# Altium project AWSAM5_CS704.PrjPcb
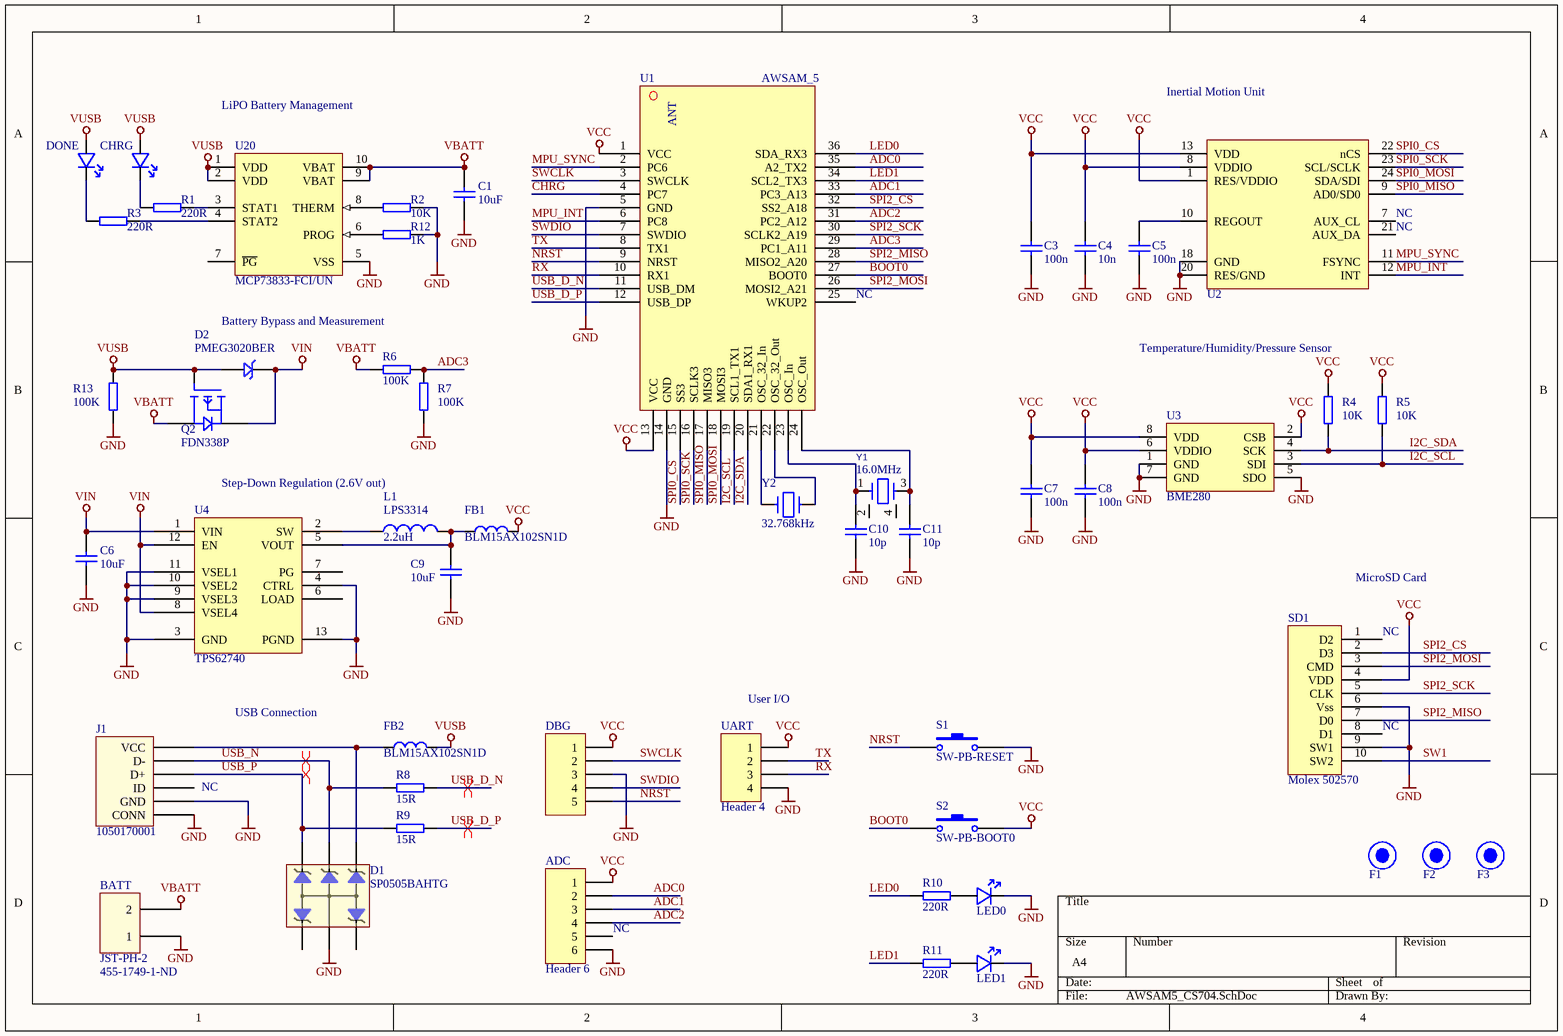
[diagram p0: AWSAM5_CS704.SchDoc]
1 sheet, 51 parts. Net scope: global (net labels, ports and power ports of the same name join across sheets).
Board files: AWSAM5_CS704.PcbDoc, AWSAM5_CS704_PANEL.PcbDoc

## Sheet AWSAM5_CS704.SchDoc
size A4; PageSetup: Record=PageOptions|CenterHorizontal=True|CenterVertical=True|PrintScale=1.00|XCorrection=1.00|YCorrection=1.00|PrintKind=0|BorderSize=5000000|LeftOffset=0|BottomOffset=0|Orientation=2|PaperLength=1000|PaperWidth=1000|Scale=100|PaperSource=7|PrintQuality=-4|MediaType=1|DitherType=10|PaperKind=A4|PrintScaleMode=1

### Parts
ADC  Header 6  [HDR1X6]
BATT  JST-PH-2  Supplier Part Number 1: 455-1749-1-ND  [JST-PH-2POS]
C1  value 10uF  [CAP0603]  (hidden comment: CAP)
C3  value 100n  [CAP0402]  (hidden comment: CAP)
C4  value 10n  [CAP0402]  (hidden comment: CAP)
C5  value 100n  [CAP0402]  (hidden comment: CAP)
C6  value 10uF  [CAP0603]  (hidden comment: CAP)
C7  value 100n  [CAP0402]  (hidden comment: CAP)
C8  value 100n  [CAP0402]  (hidden comment: CAP)
C9  value 10uF  [CAP0603]  (hidden comment: CAP)
C10  value 10p  [CAP0402]  (hidden comment: CAP)
C11  value 10p  [CAP0402]  (hidden comment: CAP)
CHRG  LED  [LED0603P]  (value not drawn)
D1  SP0505BAHTG  [SOT26A-6L]
D2  Part Number: PMEG3020BER  [SODFL350X110-2N]  (hidden comment: DIODE-SCHOTTKY)
DBG  (no value)  [HDR1X5]
DONE  LED  [LED0603P]  (value not drawn)
F1  FIDUCIAL  [FIDUCIAL-1MM]  (value not drawn)
F2  FIDUCIAL  [FIDUCIAL-1MM]  (value not drawn)
F3  FIDUCIAL  [FIDUCIAL-1MM]  (value not drawn)
FB1  Part Number: BLM15AX102SN1D  [IND0402]  (hidden comment: IND)
FB2  Part Number: BLM15AX102SN1D  [IND0402]  (hidden comment: IND)
J1  1050170001  [1050170001]
L1  LPS3314  value 2.2uH  [CoilCraft- LPS3314]
LED0  LED  [LED0603P]  (value not drawn)
LED1  LED  [LED0603P]  (value not drawn)
Q2  Part Number: FDN338P  [SOT23-3]  (hidden comment: FET-PCH-DIODE)
R1  value 220R  [SMT0402]  (hidden comment: Resistor)
R2  value 10K  [SMT0402]  (hidden comment: RES)
R3  value 220R  [SMT0402]  (hidden comment: Resistor)
R4  value 10K  [SMT0402]  (hidden comment: RES)
R5  value 10K  [SMT0402]  (hidden comment: RES)
R6  value 100K  [SMT0402]  (hidden comment: RES)
R7  value 100K  [SMT0402]  (hidden comment: RES)
R8  15R  [SMT0402]
R9  value 15R  [SMT0402]  (hidden comment: Resistor)
R10  value 220R  [SMT0402]  (hidden comment: Resistor)
R11  value 220R  [SMT0402]  (hidden comment: Resistor)
R12  value 1K  [SMT0402]  (hidden comment: RES)
R13  value 100K  [RES0402]  (hidden comment: RES)
S1  SW-PB-RESET  [MC32882 Switch]
S2  SW-PB-BOOT0  [MC32882 Switch]
SD1  Molex 502570  [micro SD]
U1  AWSAM_5  [AWSAM_5]
U2  MPU-9250  [QFN40P300X300X105_HS-25L]  (value not drawn)
U3  BME280  [BME280]
U4  TPS62740  [TPS62740_12Pin]
U20  MCP73833-FCI/UN  [MSOP-UN10_N]
UART  Header 4  [HDR1X4]
Y1  value 16.0MHz  [AP7-00061]  (hidden comment: TSX-3225)
Y2  Frequency: 32.768kHz  [SMD Crystal 32kHz]  (hidden comment: CM315-32.768KEZF-UT)

### Nets
GND: ADC.6 BATT.1 C1.1 C3.1 C4.1 C5.1 C6.1 C7.1 C8.1 C9.1 C10.1 C11.1 D1.2 DBG.3 J1.0(CONN) J1.5(GND) LED0.2 LED1.2 R2.2 R7.1 R12.2 R13.1 S1.2 SD1.6(Vss) SD1.9(SW1) U1.5(GND) U1.14(GND) U2.18(GND) U2.20(RES/GND) U3.1(GND) U3.5(SDO) U3.7(GND) U4.3(GND) U4.4(CTRL) U4.9(VSEL3) U4.10(VSEL2) U4.11(VSEL1) U4.13(PGND) U20.5(VSS) UART.4
VBATT: BATT.2 C1.2 Q2.3 R6.2 U20.9(VBAT) U20.10(VBAT)
VCC: ADC.1 C3.2 C4.2 C7.2 C8.2 DBG.1 FB1.2 R4.2 R5.2 S2.2 SD1.4(VDD) U1.1(VCC) U1.13(VCC) U2.1(RES/VDDIO) U2.8(VDDIO) U2.13(VDD) U3.2(CSB) U3.6(VDDIO) U3.8(VDD) UART.1
VIN: C6.2 D2.1 Q2.2 U4.1(VIN) U4.8(VSEL4) U4.12(EN)
VUSB: CHRG.1 D2.2 DONE.1 FB2.2 Q2.1 R13.2 U20.1(VDD) U20.2(VDD)
ADC0: ADC.2 U1.35(A2_TX2)
ADC1: ADC.3 U1.33(PC3_A13)
ADC2: ADC.4 U1.31(PC2_A12)
ADC3: R6.1 R7.2 U1.29(PC1_A11)
BOOT0: S2.1 U1.27(BOOT0)
CHRG: U1.4(PC7)
I2C_SCL: R5.1 U1.19(SCL1_TX1) U3.3(SDI)
I2C_SDA: R4.1 U1.20(SDA1_RX1) U3.4(SCK)
LED0: R10.2 U1.36(SDA_RX3)
LED1: R11.2 U1.34(SCL2_TX3)
MPU_INT: U1.6(PC8) U2.12(INT)
MPU_SYNC: U1.2(PC6) U2.11(FSYNC)
NRST: DBG.5 S1.1 U1.9(NRST)
RX: U1.10(RX1) UART.3
SPI0_CS: U1.15(SS3) U2.22(nCS)
SPI0_MISO: U1.17(MISO3) U2.9(AD0/SD0)
SPI0_MOSI: U1.18(MOSI3) U2.24(SDA/SDI)
SPI0_SCK: U1.16(SCLK3) U2.23(SCL/SCLK)
SPI2_CS: SD1.2(D3) U1.32(SS2_A18)
SPI2_MISO: SD1.7(D0) U1.28(MISO2_A20)
SPI2_MOSI: SD1.3(CMD) U1.26(MOSI2_A21)
SPI2_SCK: SD1.5(CLK) U1.30(SCLK2_A19)
SW1: SD1.10(SW2)
SWCLK: DBG.2 U1.3(SWCLK)
SWDIO: DBG.4 U1.7(SWDIO)
TX: U1.8(TX1) UART.2
USB_D_N: R8.1 U1.11(USB_DM)
USB_D_P: R9.1 U1.12(USB_DP)
USB_N: D1.5 J1.2(D-) R8.2
USB_P: D1.6 J1.3(D+) R9.2
NetC5_2: C5.2 U2.10(REGOUT)
NetC9_2: C9.2 FB1.1 L1.2 U4.5(VOUT)
NetC10_2: C10.2 U1.23(OSC_In) Y1.1(IN)
NetC11_2: C11.2 U1.24(OSC_Out) Y1.3(OUT)
NetCHRG_2: CHRG.2 R1.2
NetD1_4: D1.4 FB2.1 J1.1(VCC)
NetDONE_2: DONE.2 R3.2
NetL1_1: L1.1 U4.2(SW)
NetLED0_1: LED0.1 R10.1
NetLED1_1: LED1.1 R11.1
NetR1_1: R1.1 U20.3(STAT1)
NetR2_1: R2.1 U20.8(THERM)
NetR3_1: R3.1 U20.4(STAT2)
NetR12_1: R12.1 U20.6(PROG)
NetU1_21: U1.21(OSC_32_In) Y2.1(IN)
NetU1_22: U1.22(OSC_32_Out) Y2.2(OUT)

Not connected (* = marked no-connect by the designer): ADC 5; D1 1 3; J1 4(ID); SD1 1(D2) 8(D1); U1 25(WKUP2); U2 7(AUX_CL) 21(AUX_DA); U4 6(LOAD) 7(PG); U20 7(~{PG}); Y1 2(GND) 4(GND)

### Layout directives
differential pair: USB_D_N, USB_D_P, USB_N, USB_P

### Notes on the sheet
- LiPO Battery Management
- Inertial Motion Unit
- (near U2) NC
- (near U1) NC
- Battery Bypass and Measurement
- Temperature/Humidity/Pressure Sensor
- Step-Down Regulation (2.6V out)
- MicroSD Card
- (near SD1) NC
- USB Connection
- (near UART) User I/O
- (near J1) NC
- (near ADC) NC
- (in symbol AWSAM_5) ANT

### Library data of the parts
ADC = Header 6: Header, 6-Pin; LatestRevisionDate: 17-Jul-2002; LatestRevisionNote: Re-released for DXP Platform.; Publisher: Altium Limited
BATT = S2B-PH-SM4-TB: CONN SM JST PH 2-POS; Supplier 1: Digi-Key
C1 C6 C9 = CAP-SM-0603-X5R-10uF: CAP SM 0603 X5R 10uF; Manufacturer: GENERIC; Part Number: CAP-SM-0603-X5R-10uF; Package: 0603
C3 C5 C7 C8 = CAP-SM-0402-X7R-100NF: CAP SM 0402 X7R 100NF; Manufacturer: GENERIC; Part Number: CAP-SM-0402-X7R-100NF; Package: 0402
C4 = CAP-SM-0402-X7R-10NF: CAP SM 0402 X7R 10NF; Manufacturer: GENERIC; Part Number: CAP-SM-0402-X7R-10NF; Package: 0402
C10 C11 = CAP-SM-0402-NP0-10PF: CAP SM 0402 NP0 10PF; Manufacturer: GENERIC; Part Number: CAP-SM-0402-NP0-10PF; Package: 0402
CHRG DONE LED0 LED1 = LED-0603-RED: LED 0603 RED; Manufacturer: GENERIC; Part Number: LED-0603-RED; Package: 0603
D1 = SP0505BAHTG: IC DIODE TRANS VOLT SUPPR 5 PACKAGE; Manufacturer: Little Fuse; Part Number: SP0505BAHTG; Package: SOT23-5
D2 = PMEG3020BER: DIODE  SCHOTTKY 1A 40V; Manufacturer: Panasonic; Package: 0402
DBG = Header 5: Header, 5-Pin; LatestRevisionDate: 17-Jul-2002; LatestRevisionNote: Re-released for DXP Platform.; Publisher: Altium Limited
F1-F3 = FIDUCIAL-1MM: FIDUCIAL 1MM CENTER; Part Number: FIDUCIAL-1MM
FB1 FB2 = BLM15AX102SN1D: FERRITE BEAD 350mA 0402; Manufacturer: Murata; Package: 0402
J1 = 1050170001: CONN RCPT MICRO USB R/A SMD; Manufacturer: MOLEX; Part Number: 1050170001
L1 = Inductor: Code_IEC: 1005; Published: 8-Jun-2000; LatestRevisionDate: 29-May-2009; LatestRevisionNote: IPC-7351 Footprint Added.; PackageReference: 0402-A; Publisher: Altium Limited; PackageDescription: Chip Inductor; Code_JEITA: 0402; Mouser: 994-LPS3314-222MRB; SLink: http://nz.mouser.com/ProductDetail/Coilcraft/LPS3314-222MRB/?qs=%2fha2pyFaduh2AdVM2MOyaO78%2fz9pqEgQ6FaCzET4PqZ7pHcWvXsWv0DS1bzafKVX
Q2 = FDN338P: MOSFET P-CH 20V 115MA SOT23-3; Manufacturer: Fairchild; Package: SOT23-3
R1 R3 R10 R11 = RES-SM-0603-220R: RES SM 0603 220R; Supplier 1: Farnell; Supplier 2: Digi-Key; Supplier Part Number 1: 1127454; Supplier Part Number 2: 541-220HCT-ND
R2 R4 R5 = RES-SM-0402-10K: RES SM 0402 10K; Manufacturer: GENERIC; Part Number: RES-SM-0402-10K; Package: 0402
R6 R7 R13 = RES-SM-0402-100K: RES SM 0402 100K; Manufacturer: GENERIC; Part Number: RES-SM-0402-100K; Package: 0402
R8 R9 = RES-SM-0603-22K: RES SM 0603 22K; Supplier 1: Farnell; Supplier 2: Digi-Key; Supplier Part Number 1: 1738922; Supplier Part Number 2: 541-22.0KHCT-ND
  R8: Value: 15R
R12 = RES-SM-0402-1K: RES SM 0402 1K; Manufacturer: GENERIC; Part Number: RES-SM-0402-1K; Package: 0402
S1 S2 = SW-PB: Switch; Published: 24-Mar-1999; LatestRevisionDate: 17-Jul-2002; LatestRevisionNote: Re-released for DXP Platform.; PackageReference: SPST-2; Publisher: Altium Limited; PackageDescription: Switch; 2 Leads; SLink: http://nz.element14.com/multicomp/mc32882/switch-tactile-50ma-12vdc-smd/dp/2396053; Element14: 2396053
SD1 = MOLEX-502570: CONN SM MICROSD
U2 = MPU-9250: IC 9DOF IMU; Manufacturer: InvenSense; Part Number: MPU-9250; Package: QFN24-3x3
U3 = BME280: IC SENSOR PRESS/HUMID/TEMP; Manufacturer: Bosch; Part Number: BME280; Package: 2.5x2.5x0.93
U4 = TPS62740: IC REG BUCK; Manufacturer: Texas Instruments; Part Number: TPS62740; Package: WSON
U20 = MCP73833-FCI/UN: Stand-Alone Linear Li-Ion/Li-Polymer Charge Management Controller with Power-Good Output, 4.2V, 10-Pin MSOP, Industrial Temperature; Published: 29-Jan-2009; LatestRevisionDate: 27-Nov-2009; LatestRevisionNote: Updated to datasheet revision B, May-2009; DatasheetVersion: revB, May-2009; PackageVersion: revBB, Aug-2009; PackageReference: MSOP-UN10; Publisher: Altium Limited; PackageDescription: 10-Lead Plastic Micro Small Outline Package (UN) [MSOP]; Supplier 1: Digi-Key; Supplier Part Number 1: MCP73833-FCI/UN-ND; Supplier 2: Farnell; Supplier Part Number 2: 1605576; ComponentLink1Description: Datasheet; ComponentLink1URL: http://ww1.microchip.com/downloads/en/DeviceDoc/22005b.pdf; ComponentLink2Description: Packaging Specification; ComponentLink2URL: http://www.microchip.com/stellent/groups/techpub_sg/documents/packagingspec/en012702.pdf; ComponentLink3Description: Microchip.com Home; ComponentLink3URL: http://www.microchip.com/
UART = Header 4: Header, 4-Pin; LatestRevisionDate: 17-Jul-2002; LatestRevisionNote: Re-released for DXP Platform.; Publisher: Altium Limited
Y1 = A07-0078: 16MHz uXtal, 3.2 x 2.5 mm SMD, CL=9pF, 15PPM, ESR=80ohm(Max.; PartGroup: Frequency devices,Crystals,SMD; Manufacturer: Epson Toyocom; MPN: TSX-3225 16.0000MF09Z-AC3; TemperatureRange: -20 deg C to 70 deg C; ComponentStatus: 'Active (verified)'; Dig: SER3628CT-ND; AN: A07-0078; Tolerance: 15ppm; Height: 0.699999988079071; FootprintStatus: 'New (Not verified)'; Element14: 1712841; SLink: http://nz.element14.com/epson/x1e0000210013/crystal-tsx-3225-16-mhz-9-pf/dp/1712841
Y2 = CM315-32.768KEZF-UT: CRYSTAL 32.768KHZ 12.5PF SMD; Manufacturer: Citizen Finetech Miyota; Frequency Tolerance: ±10ppm; ESR (Equivalent Series Resistance): 70 kOhm; Manufacturer Part Number: CM315-32.768KEZF-UT; Load Capacitance: 12.5pF; Package / Case: 2-SMD; Size / Dimension: 0.126" L x 0.059" W (3.20mm x 1.50mm); Height: 0.035" (0.90mm); ComponentLink1URL: http://cfm.citizen.co.jp/english/product/pdf/CM315.pdf; ComponentLink1Description: http://cfm.citizen.co.jp/english/product/pdf/CM315.pdf; Supplier: Digi-Key; Supplier Part Number: XC1617CT-ND; SLink: http://www.digikey.com/product-detail/en/ECS-.327-12.5-34B/XC1617CT-ND/1693786